# EAGLE design Power (EAGLE 4.16)
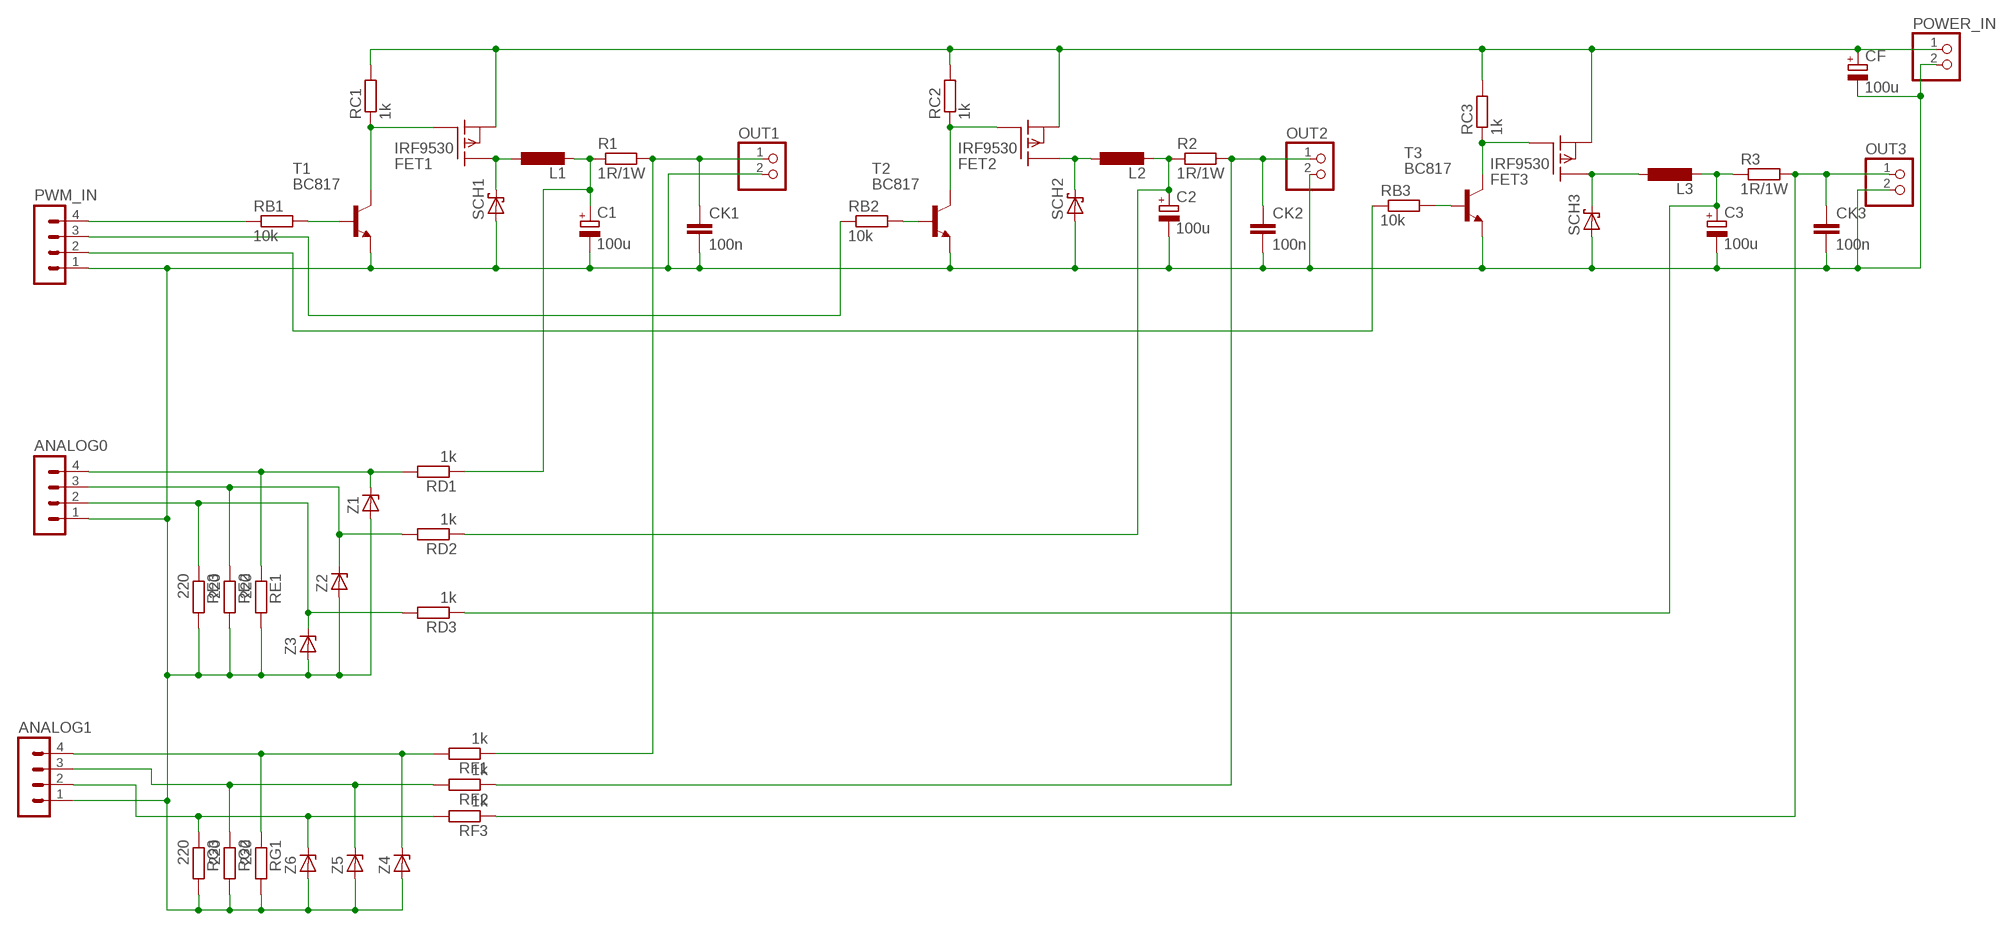
[diagram p0: schematic, sheet 1]

## Parts
ANALOG0  MA04-1  [MA04-1]
ANALOG1  MA04-1  [MA04-1]
C1  100u  CPOL-EU153CLV-1014  [153CLV-1014]
C2  100u  CPOL-EU153CLV-1014  [153CLV-1014]
C3  100u  CPOL-EU153CLV-1014  [153CLV-1014]
CF  100u  CPOL-EU153CLV-1014  [153CLV-1014]
CK1  100n  C-EUC1210  [C1210]
CK2  100n  C-EUC1210  [C1210]
CK3  100n  C-EUC1210  [C1210]
FET1  IRF9530  [TO220]
FET2  IRF9530  [TO220]
FET3  IRF9530  [TO220]
L1  L-EUTJ4-U2  [TJ4-U2]
L2  L-EUTJ4-U2  [TJ4-U2]
L3  L-EUTJ4-U2  [TJ4-U2]
OUT1  PINHD-1X2  [1X02]
OUT2  PINHD-1X2  [1X02]
OUT3  PINHD-1X2  [1X02]
POWER_IN  PINHD-1X2  [1X02]
PWM_IN  MA04-1  [MA04-1]
R1  1R/1W  R-EU_RDH/15  [RDH/15]
R2  1R/1W  R-EU_RDH/15  [RDH/15]
R3  1R/1W  R-EU_RDH/15  [RDH/15]
RB1  10k  R-EU_M1206  [M1206]
RB2  10k  R-EU_M1206  [M1206]
RB3  10k  R-EU_M1206  [M1206]
RC1  1k  R-EU_M1206  [M1206]
RC2  1k  R-EU_M1206  [M1206]
RC3  1k  R-EU_M1206  [M1206]
RD1  1k  R-EU_M1206  [M1206]
RD2  1k  R-EU_M1206  [M1206]
RD3  1k  R-EU_M1206  [M1206]
RE1  220  R-EU_M1206  [M1206]
RE2  220  R-EU_M1206  [M1206]
RE3  220  R-EU_M1206  [M1206]
RF1  1k  R-EU_M1206  [M1206]
RF2  1k  R-EU_M1206  [M1206]
RF3  1k  R-EU_M1206  [M1206]
RG1  220  R-EU_M1206  [M1206]
RG2  220  R-EU_M1206  [M1206]
RG3  220  R-EU_M1206  [M1206]
SCH1  SCHOTTKY-DIODESMC  [SMC]
SCH2  SCHOTTKY-DIODESMC  [SMC]
SCH3  SCHOTTKY-DIODESMC  [SMC]
T1  BC817  BC817-16SMD  [SOT23-BEC]
T2  BC817  BC817-16SMD  [SOT23-BEC]
T3  BC817  BC817-16SMD  [SOT23-BEC]
Z1  ZENER-DIODESMB  [SMB]
Z2  ZENER-DIODESMB  [SMB]
Z3  ZENER-DIODESMB  [SMB]
Z4  ZENER-DIODESMB  [SMB]
Z5  ZENER-DIODESMB  [SMB]
Z6  ZENER-DIODESMB  [SMB]

## Nets
AAA: CK1.1 OUT1.1 R1.2 RF1.1
N$1: RB1.2 T1.B
N$2: FET1.1(G) RC1.1 T1.C
N$3: FET1.2(D) L1.1 SCH1.C
N$4: C1.+ L1.2 R1.1 RD1.1
N$5: PWM_IN.3 RB2.1
N$6: PWM_IN.4 RB1.1
N$7: ANALOG0.4 RD1.2 RE1.1 Z1.C
N$8: ANALOG0.1 ANALOG1.1 C1.- C2.- C3.- CF.- CK1.2 CK2.2 CK3.2 OUT1.2 OUT2.2 OUT3.2 POWER_IN.2 PWM_IN.1 RE1.2 RE2.2 RE3.2 RG1.2 RG2.2 RG3.2 SCH1.A SCH2.A SCH3.A T1.E T2.E T3.E Z1.A Z2.A Z3.A Z4.A Z5.A Z6.A
N$9: ANALOG0.3 RD2.2 RE2.1 Z2.C
N$10: ANALOG0.2 RD3.2 RE3.1 Z3.C
N$12: RB2.2 T2.B
N$13: ANALOG1.4 RF1.2 RG1.1 Z4.C
N$14: ANALOG1.3 RF2.2 RG2.1 Z5.C
N$15: ANALOG1.2 RF3.2 RG3.1 Z6.C
N$16: C2.+ L2.2 R2.1 RD2.1
N$18: CK2.1 OUT2.1 R2.2 RF2.1
N$19: FET2.2(D) L2.1 SCH2.C
N$20: FET2.1(G) RC2.1 T2.C
N$21: PWM_IN.2 RB3.1
N$23: FET3.1(G) RC3.1 T3.C
N$24: CK3.1 OUT3.1 R3.2 RF3.1
N$25: C3.+ L3.2 R3.1 RD3.1
N$26: FET3.2(D) L3.1 SCH3.C
N$27: CF.+ FET1.3(S) FET2.3(S) FET3.3(S) POWER_IN.1 RC1.2 RC2.2 RC3.2
N$29: RB3.2 T3.B

## Library data of the parts
ANALOG0 ANALOG1 PWM_IN = con-lstb:MA04-1: PIN HEADER
C1-C3 CF = rcl:CPOL-EU: POLARIZED CAPACITOR, European symbol
CK1-CK3 = rcl:C-EU: CAPACITOR, European symbol
FET1-FET3 = transistor-fet:IRF9530: P-Channel Enhancement MOSFET (HEXFET); -100V; -12A; 0,3Ohm
L1-L3 = rcl:L-EU: INDUCTOR, European symbol
OUT1-OUT3 POWER_IN = pinhead:PINHD-1X2: PIN HEADER
R1-R3 RB1-RB3 RC1-RC3 RD1-RD3 RE1-RE3 RF1-RF3 RG1-RG3 = rcl:R-EU_: RESISTOR, European symbol
SCH1-SCH3 = diode:SCHOTTKY-DIODE: Schottky Diode
T1-T3 = transistor-npn:BC817*: NPN Transistor
Z1-Z6 = diode:ZENER-DIODE: Z-Diode

## Board
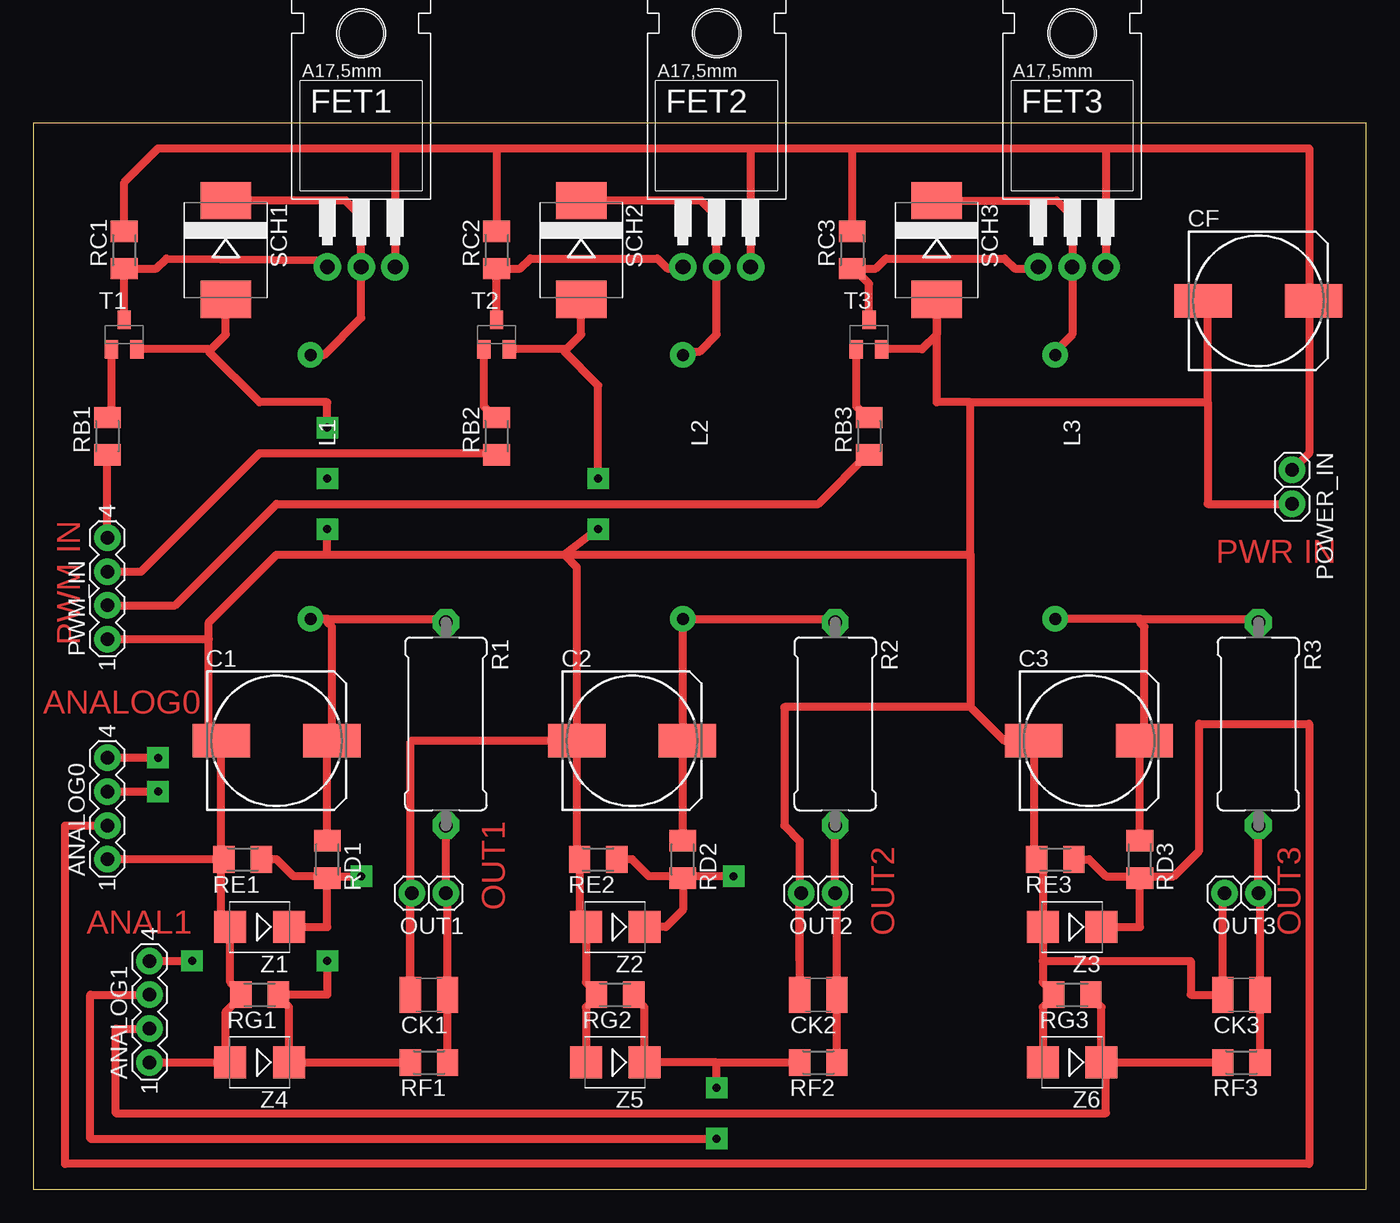
[diagram p1: board, top side]
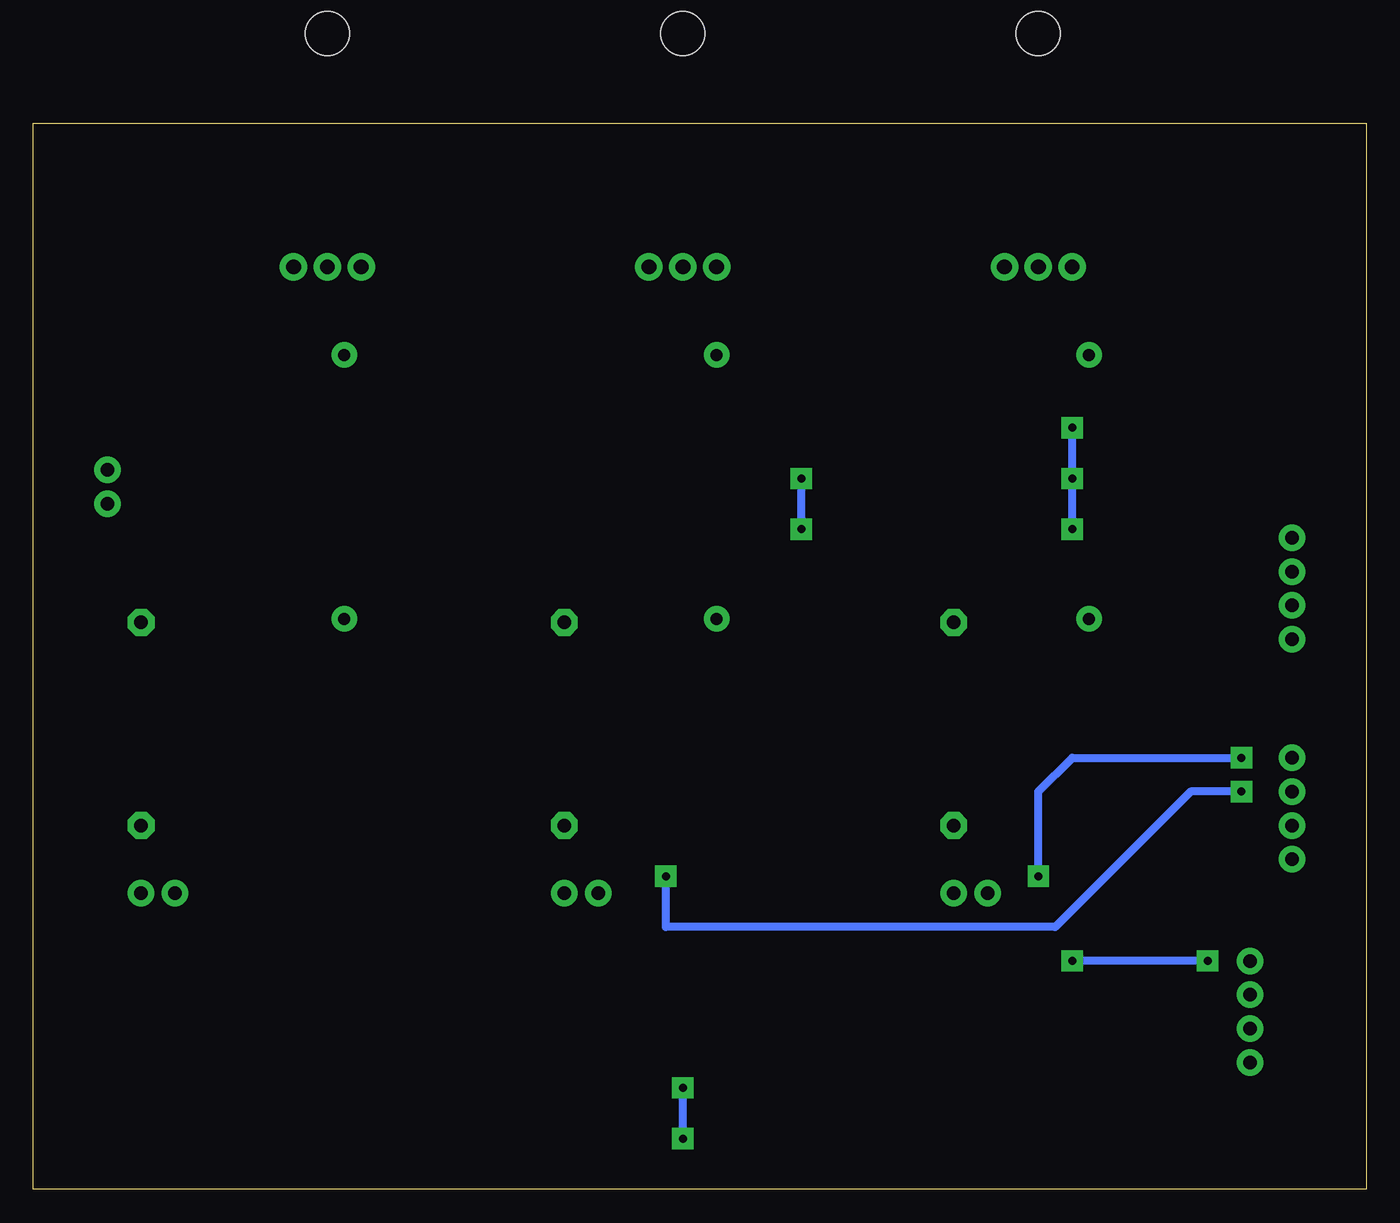
[diagram p2: board, bottom side, seen from below]

Size 100 x 80 mm. Coordinates in mm from the lower left corner, seen from the top.
Outline: 0,0 100,0 100,80 0,80 0,0
Copper layers (1*16): Top 0.0356mm / dielectric 1.5011mm / Bottom 0.0356mm
Design rules "default": minimum track width 0.1mm, minimum drill 1mil, track to track 0.25mm, track to pad 0.25mm, pad to pad 0.25mm, via to via 0.25mm, smd to smd 0.25mm, copper to edge 2.5mm, drill to drill 80mil, minimum pad ring 0.5mm, minimum via ring 0.5mm, stop-mask expansion 4mil, vias tented up to drill 0mil, thermal gap 10mil

### Footprints (pad centres in the part's own frame; a part is rotated, then mirrored left to right if it is on the bottom)
MA04-1 = drill 1.016 long: 1 -3.81,0; 2 -1.27,0; 3 1.27,0; 4 3.81,0
153CLV-1014 = smd 4.3 x 2.5: + 4.15,0; - -4.15,0
C1210 = smd 1.6 x 2.7: 1 -1.4,0; 2 1.4,0
TO220 = drill 1.118 long: 1 -2.54,-6.35; 2 0,-6.35; 3 2.54,-6.35 | hole 3.302: 0,11.176
TJ4-U2 = drill 0.9 round: 1 -9.9,0; 2 9.9,0
1X02 = drill 1.016 long: 1 -1.27,0; 2 1.27,0
RDH/15 = drill 1.016 octagon: 1 -7.62,0; 2 7.62,0
M1206 = smd 1.6 x 2: 1 -1.4,0; 2 1.4,0
SMC = smd 2.8 x 3.8: A 3.7,0; C -3.7,0
SOT23-BEC = smd 1 x 1.4: B -0.95,-1.1; C 0,1.1; E 0.95,-1.1
SMB = smd 2.4 x 2.4: A 2.2,0; C -2.2,0

### Placement (x,y rotation side)
ANALOG0  5.55,28.57 90 top
ANALOG1  8.73,13.33 90 top
C1  18.25,33.65 0 top
C2  44.92,33.65 0 top
C3  79.21,33.65 0 top
CF  91.91,66.67 0 top
CK1  29.68,14.6 180 top
CK2  58.89,14.6 180 top
CK3  90.64,14.6 180 top
FET1  24.6,75.56 0 top
FET2  51.27,75.56 0 top
FET3  77.94,75.56 0 top
L1  20.79,52.7 270 top
L2  48.73,52.7 270 top
L3  76.67,52.7 270 top
OUT1  29.68,22.22 180 top
OUT2  58.89,22.22 180 top
OUT3  90.64,22.22 180 top
POWER_IN  94.45,52.7 270 top
PWM_IN  5.55,45.08 90 top
R1  30.95,34.92 270 top
R2  60.16,34.92 270 top
R3  91.91,34.92 270 top
RB1  5.55,56.51 90 top
RB2  34.76,56.51 90 top
RB3  62.7,56.51 90 top
RC1  6.82,70.48 90 top
RC2  34.76,70.48 90 top
RC3  61.43,70.48 90 top
RD1  22.06,24.76 270 top
RD2  48.73,24.76 270 top
RD3  83.02,24.76 270 top
RE1  15.71,24.76 180 top
RE2  42.38,24.76 180 top
RE3  76.67,24.76 180 top
RF1  29.68,9.52 180 top
RF2  58.89,9.52 180 top
RF3  90.64,9.52 180 top
RG1  16.98,14.6 180 top
RG2  43.65,14.6 180 top
RG3  77.94,14.6 180 top
SCH1  14.44,70.48 270 top
SCH2  41.11,70.48 270 top
SCH3  67.78,70.48 270 top
T1  6.82,64.13 0 top
T2  34.76,64.13 0 top
T3  62.7,64.13 0 top
Z1  16.98,19.68 180 top
Z2  43.65,19.68 180 top
Z3  77.94,19.68 180 top
Z4  16.98,9.52 180 top
Z5  43.65,9.52 180 top
Z6  77.94,9.52 180 top

### Tracks (layer width: path | path; a pad name or v marks a point on that pad's centre or on a via)
AAA
  Top 0.61: RF1.1 31.08,14.47 30.95,14.6 CK1.1 31.08,22.09 OUT1.1 R1.2
N$1
  Top 0.61: RB1.2 5.55,57.78 5.87,58.73 T1.B
N$2
  Top 0.61: RC1.1 6.82,69.21 | T1.C RC1.1 | RC1.1 9.23,69.08 10,69.84 21.93,69.71 FET1.1
N$3
  Top 0.61: L1.1 21.8,62.6 24.6,65.4 FET1.2 24.6,73.02 23.44,74.18 SCH1.C
N$4
  Top 0.61: 22.06,42.8 L1.2 | 22.06,42.8 30.69,42.8 R1.1 | 22.06,42.8 22.06,42.54 22.4,42.2 C1.+ 22.06,33.65 RD1.1
N$5
  Top 0.61: PWM_IN.3 8.09,46.35 16.98,55.24 34.76,55.24 RB2.1
N$6
  Top 0.61: 5.55,55.24 RB1.1 PWM_IN.4
N$7  (via drill 0.6)
  Top 0.61: Z1.C 22.06,19.68 RD1.2 22.06,23.49 | RE1.1 18.25,24.76 19.52,23.49 22.06,23.49 | v9.36,32.38 ANALOG0.4 | 22.06,23.49 v24.6,23.49
  Bottom 0.61: v9.36,32.38 22.06,32.38 24.6,29.84 v24.6,23.49
N$8  (via drill 0.6)
  Top 0.61: 13.17,63.03 T1.E | 13.17,63.03 13.34,63.03 14.44,64.13 SCH1.A | 14.1,24.76 14.1,20.02 14.44,19.68 Z1.A 14.78,15.53 15.71,14.6 RG1.2 15.58,14.47 14.44,13.33 14.44,9.52 | 14.1,24.76 C1.- 13.17,33.65 13.17,41.27 | 14.1,24.76 RE1.2 14.44,24.76 | 14.44,9.52 14.78,9.86 | OUT1.2 28.28,22.09 CK1.2 28.28,33.52 28.41,33.65 C2.- | 42.38,14.6 41.45,15.53 Z2.A 41.11,19.68 40.98,19.81 RE2.2 41.11,24.76 40.77,25.1 C2.- | 42.38,14.6 RG2.2 | Z5.A 41.45,13.67 42.38,14.6 | 57.49,17.14 CK2.2 | 57.49,17.14 57.49,22.09 OUT2.2 | T3.E 66.68,63.03 67.78,64.13 SCH3.A 67.78,59.05 70.32,59.05 | 70.32,59.05 88.1,59.05 | 88.1,59.05 88.1,51.43 POWER_IN.2 | CF.- 88.1,66.67 88.1,59.05 | Z6.A 75.74,13.67 76.67,14.6 | 76.67,14.6 RG3.2 | 75.74,17.14 Z3.A 75.74,24.42 75.4,24.76 | 75.74,17.14 75.74,15.53 76.67,14.6 | 75.4,24.76 RE3.2 | 75.4,24.76 75.06,25.1 C3.- 72.86,33.65 70.32,36.19 | 70.32,47.62 70.32,36.19 | 70.32,47.62 70.32,59.05 | OUT3.2 89.24,22.09 CK3.2 86.83,14.6 86.83,17.14 75.74,17.14 | 14.1,24.76 ANALOG0.1 | ANALOG1.1 14.44,9.52 | 14.44,9.52 Z4.A | 39.84,63.03 T2.E | 39.84,63.03 40.01,63.03 41.11,64.13 SCH2.A | C2.- 40.77,46.69 39.84,47.62 | 22.06,47.62 39.84,47.62 | 13.17,41.27 13.17,42.54 18.25,47.62 22.06,47.62 | 13.17,41.27 PWM_IN.1 | 39.84,47.62 70.32,47.62 | 57.49,17.14 57.49,26.16 56.35,27.3 56.35,36.19 70.32,36.19 | 39.84,47.62 v42.38,49.53 | v42.38,53.34 42.38,60.32 39.84,62.86 39.84,63.03 | 22.06,47.62 v22.06,49.53 | v22.06,57.15 22.06,59.05 16.98,59.05 13.17,62.86 13.17,63.03 | C2.- 41.11,33.65
  Bottom 0.61: v42.38,49.53 v42.38,53.34 | v22.06,49.53 v22.06,53.34 v22.06,57.15
N$9  (via drill 0.6)
  Top 0.61: Z2.C 47.46,19.68 48.73,20.95 RD2.2 48.73,23.49 | RE2.1 44.92,24.76 46.19,23.49 48.73,23.49 | ANALOG0.3 v9.36,29.84 | v52.54,23.49 48.73,23.49
  Bottom 0.61: v9.36,29.84 13.17,29.84 23.33,19.68 52.54,19.68 v52.54,23.49
N$10
  Top 0.61: Z3.C 83.02,19.68 RD3.2 83.02,23.49 | RE3.1 79.21,24.76 80.48,23.49 83.02,23.49 | 83.02,23.49 85.56,23.49 87.47,25.39 87.47,34.92 95.72,34.92 95.72,1.9 2.38,1.9 2.38,27.3 ANALOG0.2
N$12
  Top 0.61: RB2.2 34.76,57.78 33.81,58.73 T2.B
N$13  (via drill 0.6)
  Top 0.61: RF1.2 Z4.C 19.18,13.67 18.25,14.6 | ANALOG1.4 v11.9,17.14 | v22.06,17.14 22.06,14.6 18.25,14.6 | 18.25,14.6 RG1.1
  Bottom 0.61: v11.9,17.14 v22.06,17.14
N$14  (via drill 0.6)
  Top 0.61: RG2.1 44.92,14.6 45.85,13.67 Z5.C 51.27,9.52 | 57.62,9.52 RF2.2 51.27,9.52 | ANALOG1.3 4.28,14.6 4.28,3.8 v51.27,3.8 | v51.27,7.62 51.27,9.52
  Bottom 0.61: v51.27,3.8 v51.27,7.62
N$15
  Top 0.61: 89.37,9.52 RF3.2 80.48,9.52 | RG3.1 79.21,14.6 80.14,13.67 Z6.C 80.48,9.52 | ANALOG1.2 6.18,12.06 6.18,5.71 80.48,5.71 80.48,9.52
N$16
  Top 0.61: R2.1 59.9,42.8 L2.2 48.73,33.65 | 48.73,33.65 C2.+ | RD2.1 48.73,33.65
N$18
  Top 0.61: RF2.1 60.29,14.47 60.16,14.6 CK2.1 60.29,22.09 OUT2.1 R2.2
N$19
  Top 0.61: L2.1 48.73,62.86 50,62.86 51.27,64.13 FET2.2 51.27,73.02 50.11,74.18 SCH2.C
N$20
  Top 0.61: RC2.1 34.76,69.21 | T2.C RC2.1 | RC2.1 36.53,69.08 37.3,69.84 46.82,69.84 47.59,69.08 48.6,69.08 FET2.1
N$21
  Top 0.61: PWM_IN.2 10.63,43.81 18.25,51.43 58.89,51.43 62.7,55.24 RB3.1
N$23
  Top 0.61: FET3.1 75.27,69.08 73.62,69.08 72.86,69.84 63.97,69.84 63.2,69.08 RC3.1 61.43,69.21 62.7,67.94 T3.C
N$24
  Top 0.61: RF3.1 91.91,9.52 92.04,9.65 CK3.1 92.04,22.09 OUT3.1 R3.2
N$25
  Top 0.61: 83.02,42.8 L3.2 | 83.02,42.8 91.65,42.8 R3.1 | 83.02,42.8 83.02,42.54 83.36,42.2 C3.+ 83.02,33.65 RD3.1
N$26
  Top 0.61: L3.1 76.67,62.86 77.94,64.13 FET3.2 77.94,73.02 76.78,74.18 SCH3.C
N$27
  Top 0.61: RC1.2 6.82,75.56 9.36,78.1 27.14,78.1 | 27.14,78.1 FET1.3 | 53.81,78.1 FET2.3 | 27.14,78.1 34.76,78.1 | 34.76,78.1 53.81,78.1 | 61.43,78.1 RC3.2 | 53.81,78.1 61.43,78.1 | 61.43,78.1 80.48,78.1 | 80.48,78.1 FET3.3 | 80.48,78.1 95.72,78.1 95.72,66.67 | 95.72,66.67 CF.+ | 34.76,78.1 RC2.2 | 95.72,66.67 95.72,55.24 POWER_IN.1
N$29
  Top 0.61: RB3.2 62.7,57.78 61.75,58.73 T3.B

### Text on the board
Top: PWM IN | PWR IN | ANALOG0 | ANAL1 | OUT1 | OUT2 | OUT3